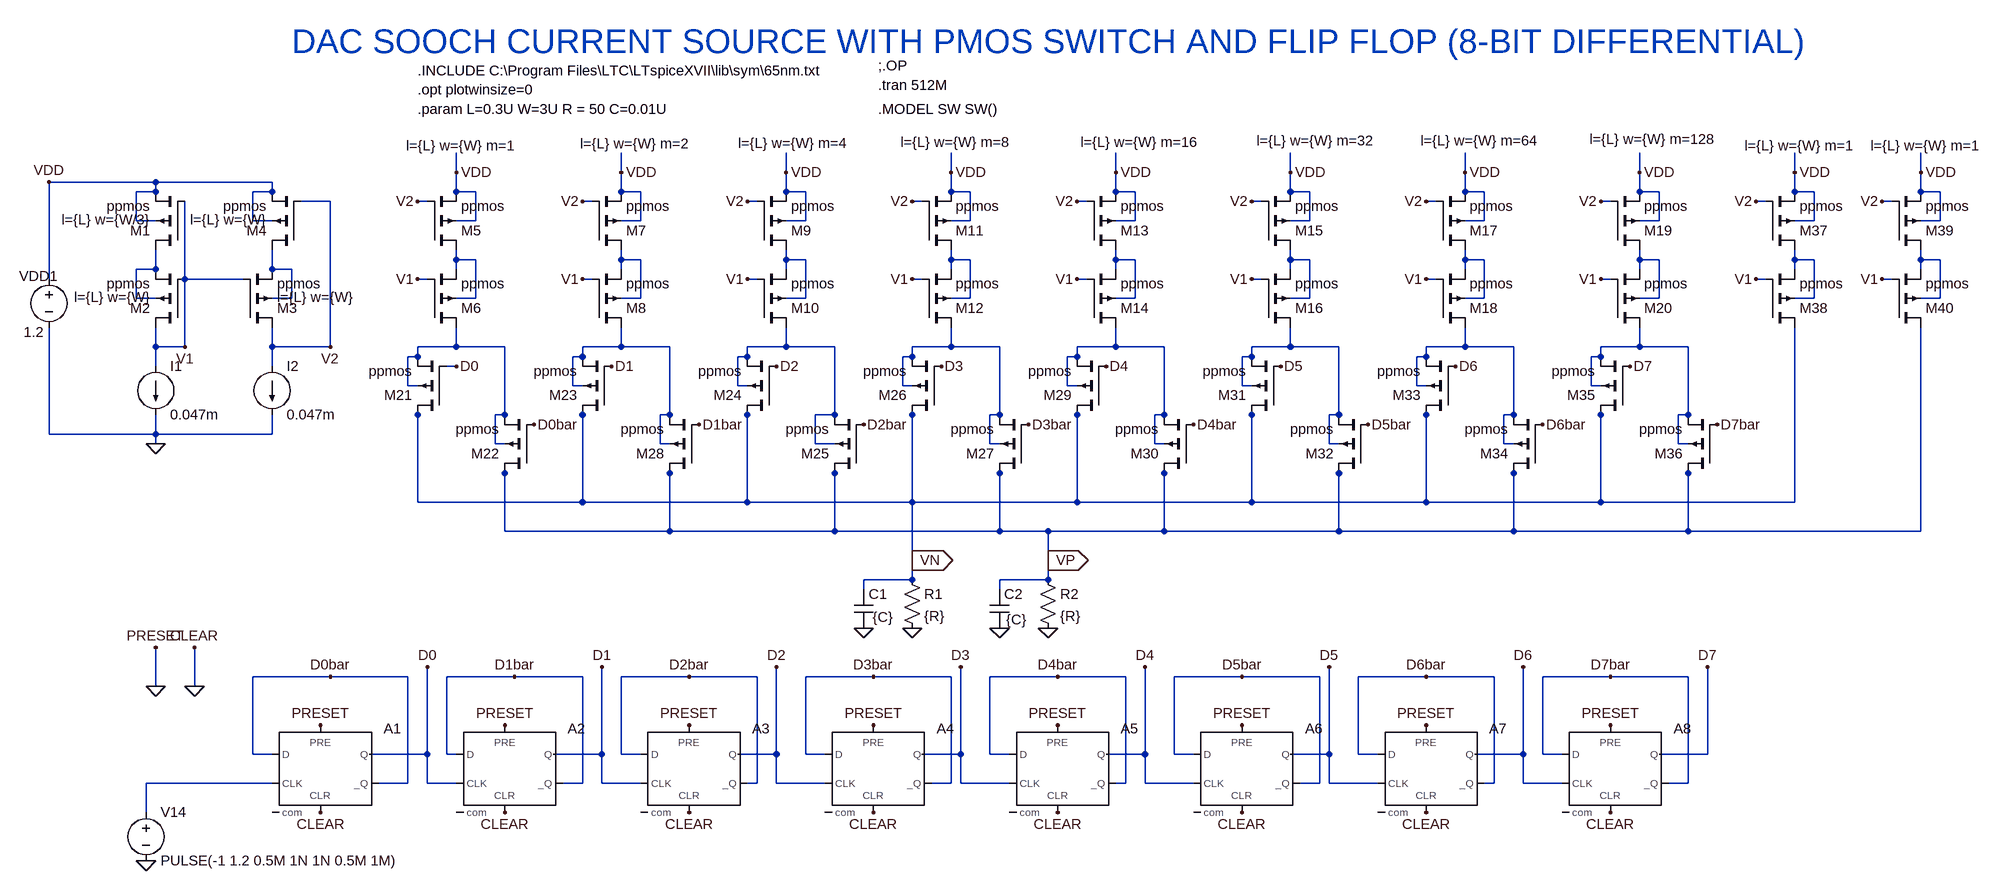
[diagram p0: schematic 106DAC_DIFF_SOOCH_PMOS_SW_FF_8BIT.asc]
106DAC_DIFF_SOOCH_PMOS_SW_FF_8BIT.asc, the LTspice schematic file:
Version 4
SHEET 1 1956 1248
WIRE -560 -336 -560 -368
WIRE -288 -336 -288 -368
WIRE -16 -336 -16 -368
WIRE 256 -336 256 -368
WIRE 528 -336 528 -368
WIRE 816 -336 816 -368
WIRE 1104 -336 1104 -368
WIRE 1392 -336 1392 -368
WIRE 1648 -336 1648 -368
WIRE 1856 -336 1856 -368
WIRE -1056 -320 -1232 -320
WIRE -864 -320 -1056 -320
WIRE -1056 -304 -1056 -320
WIRE -1056 -304 -1088 -304
WIRE -864 -304 -864 -320
WIRE -864 -304 -896 -304
WIRE -560 -304 -560 -336
WIRE -528 -304 -560 -304
WIRE -288 -304 -288 -336
WIRE -256 -304 -288 -304
WIRE -16 -304 -16 -336
WIRE 16 -304 -16 -304
WIRE 256 -304 256 -336
WIRE 288 -304 256 -304
WIRE 528 -304 528 -336
WIRE 560 -304 528 -304
WIRE 816 -304 816 -336
WIRE 848 -304 816 -304
WIRE 1104 -304 1104 -336
WIRE 1136 -304 1104 -304
WIRE 1392 -304 1392 -336
WIRE 1424 -304 1392 -304
WIRE 1648 -304 1648 -336
WIRE 1680 -304 1648 -304
WIRE 1856 -304 1856 -336
WIRE 1888 -304 1856 -304
WIRE -768 -288 -816 -288
WIRE -608 -288 -624 -288
WIRE -336 -288 -352 -288
WIRE -64 -288 -80 -288
WIRE 208 -288 192 -288
WIRE 480 -288 464 -288
WIRE 768 -288 752 -288
WIRE 1056 -288 1040 -288
WIRE 1344 -288 1328 -288
WIRE 1600 -288 1584 -288
WIRE 1808 -288 1792 -288
WIRE -1088 -256 -1088 -304
WIRE -1056 -256 -1088 -256
WIRE -896 -256 -896 -304
WIRE -864 -256 -896 -256
WIRE -528 -256 -528 -304
WIRE -528 -256 -560 -256
WIRE -256 -256 -256 -304
WIRE -256 -256 -288 -256
WIRE 16 -256 16 -304
WIRE 16 -256 -16 -256
WIRE 288 -256 288 -304
WIRE 288 -256 256 -256
WIRE 560 -256 560 -304
WIRE 560 -256 528 -256
WIRE 848 -256 848 -304
WIRE 848 -256 816 -256
WIRE 1136 -256 1136 -304
WIRE 1136 -256 1104 -256
WIRE 1424 -256 1424 -304
WIRE 1424 -256 1392 -256
WIRE 1680 -256 1680 -304
WIRE 1680 -256 1648 -256
WIRE 1888 -256 1888 -304
WIRE 1888 -256 1856 -256
WIRE -560 -192 -560 -208
WIRE -528 -192 -560 -192
WIRE -288 -192 -288 -208
WIRE -256 -192 -288 -192
WIRE -16 -192 -16 -208
WIRE 16 -192 -16 -192
WIRE 256 -192 256 -208
WIRE 288 -192 256 -192
WIRE 528 -192 528 -208
WIRE 560 -192 528 -192
WIRE 816 -192 816 -208
WIRE 848 -192 816 -192
WIRE 1104 -192 1104 -208
WIRE 1136 -192 1104 -192
WIRE 1392 -192 1392 -208
WIRE 1424 -192 1392 -192
WIRE 1648 -192 1648 -208
WIRE 1680 -192 1648 -192
WIRE 1856 -192 1856 -208
WIRE 1888 -192 1856 -192
WIRE -1056 -176 -1056 -208
WIRE -1056 -176 -1088 -176
WIRE -864 -176 -864 -208
WIRE -832 -176 -864 -176
WIRE -560 -176 -560 -192
WIRE -288 -176 -288 -192
WIRE -16 -176 -16 -192
WIRE 256 -176 256 -192
WIRE 528 -176 528 -192
WIRE 816 -176 816 -192
WIRE 1104 -176 1104 -192
WIRE 1392 -176 1392 -192
WIRE 1648 -176 1648 -192
WIRE 1856 -176 1856 -192
WIRE -1232 -160 -1232 -320
WIRE -1008 -160 -1008 -288
WIRE -912 -160 -1008 -160
WIRE -608 -160 -624 -160
WIRE -336 -160 -352 -160
WIRE -64 -160 -80 -160
WIRE 208 -160 192 -160
WIRE 480 -160 464 -160
WIRE 768 -160 752 -160
WIRE 1056 -160 1040 -160
WIRE 1344 -160 1328 -160
WIRE 1600 -160 1584 -160
WIRE 1808 -160 1792 -160
WIRE -1088 -128 -1088 -176
WIRE -1056 -128 -1088 -128
WIRE -832 -128 -832 -176
WIRE -832 -128 -864 -128
WIRE -528 -128 -528 -192
WIRE -528 -128 -560 -128
WIRE -256 -128 -256 -192
WIRE -256 -128 -288 -128
WIRE 16 -128 16 -192
WIRE 16 -128 -16 -128
WIRE 288 -128 288 -192
WIRE 288 -128 256 -128
WIRE 560 -128 560 -192
WIRE 560 -128 528 -128
WIRE 848 -128 848 -192
WIRE 848 -128 816 -128
WIRE 1136 -128 1136 -192
WIRE 1136 -128 1104 -128
WIRE 1424 -128 1424 -192
WIRE 1424 -128 1392 -128
WIRE 1680 -128 1680 -192
WIRE 1680 -128 1648 -128
WIRE 1888 -128 1888 -192
WIRE 1888 -128 1856 -128
WIRE -1056 -48 -1056 -80
WIRE -1008 -48 -1008 -160
WIRE -1008 -48 -1056 -48
WIRE -864 -48 -864 -80
WIRE -768 -48 -768 -288
WIRE -768 -48 -864 -48
WIRE -560 -48 -560 -80
WIRE -560 -48 -624 -48
WIRE -480 -48 -560 -48
WIRE -288 -48 -288 -80
WIRE -288 -48 -352 -48
WIRE -208 -48 -288 -48
WIRE -16 -48 -16 -80
WIRE -16 -48 -80 -48
WIRE 64 -48 -16 -48
WIRE 256 -48 256 -80
WIRE 256 -48 192 -48
WIRE 336 -48 256 -48
WIRE 528 -48 528 -80
WIRE 528 -48 464 -48
WIRE 608 -48 528 -48
WIRE 816 -48 816 -80
WIRE 816 -48 752 -48
WIRE 896 -48 816 -48
WIRE 1104 -48 1104 -80
WIRE 1104 -48 1040 -48
WIRE 1184 -48 1104 -48
WIRE 1392 -48 1392 -80
WIRE 1392 -48 1328 -48
WIRE 1472 -48 1392 -48
WIRE -624 -32 -624 -48
WIRE -624 -32 -640 -32
WIRE -352 -32 -352 -48
WIRE -352 -32 -368 -32
WIRE -80 -32 -80 -48
WIRE -80 -32 -96 -32
WIRE 192 -32 192 -48
WIRE 192 -32 176 -32
WIRE 464 -32 464 -48
WIRE 464 -32 448 -32
WIRE 752 -32 752 -48
WIRE 752 -32 736 -32
WIRE 1040 -32 1040 -48
WIRE 1040 -32 1024 -32
WIRE 1328 -32 1328 -48
WIRE 1328 -32 1312 -32
WIRE -1056 -16 -1056 -48
WIRE -864 -16 -864 -48
WIRE -560 -16 -576 -16
WIRE -640 16 -640 -32
WIRE -624 16 -640 16
WIRE -368 16 -368 -32
WIRE -352 16 -368 16
WIRE -96 16 -96 -32
WIRE -80 16 -96 16
WIRE 176 16 176 -32
WIRE 192 16 176 16
WIRE 448 16 448 -32
WIRE 464 16 448 16
WIRE 736 16 736 -32
WIRE 752 16 736 16
WIRE 1024 16 1024 -32
WIRE 1040 16 1024 16
WIRE 1312 16 1312 -32
WIRE 1328 16 1312 16
WIRE -624 64 -624 48
WIRE -480 64 -480 -48
WIRE -480 64 -496 64
WIRE -352 64 -352 48
WIRE -208 64 -208 -48
WIRE -208 64 -224 64
WIRE -80 64 -80 48
WIRE 64 64 64 -48
WIRE 64 64 32 64
WIRE 192 64 192 48
WIRE 336 64 336 -48
WIRE 336 64 320 64
WIRE 464 64 464 48
WIRE 608 64 608 -48
WIRE 608 64 592 64
WIRE 752 64 752 48
WIRE 896 64 896 -48
WIRE 896 64 880 64
WIRE 1040 64 1040 48
WIRE 1184 64 1184 -48
WIRE 1184 64 1168 64
WIRE 1328 64 1328 48
WIRE 1472 64 1472 -48
WIRE 1472 64 1456 64
WIRE -1232 96 -1232 -80
WIRE -1056 96 -1056 64
WIRE -1056 96 -1232 96
WIRE -864 96 -864 64
WIRE -864 96 -1056 96
WIRE -1056 112 -1056 96
WIRE -496 112 -496 64
WIRE -480 112 -496 112
WIRE -224 112 -224 64
WIRE -208 112 -224 112
WIRE 32 112 32 64
WIRE 64 112 32 112
WIRE 320 112 320 64
WIRE 336 112 320 112
WIRE 592 112 592 64
WIRE 608 112 592 112
WIRE 880 112 880 64
WIRE 896 112 880 112
WIRE 1168 112 1168 64
WIRE 1184 112 1168 112
WIRE 1456 112 1456 64
WIRE 1472 112 1456 112
WIRE -480 160 -480 144
WIRE -208 160 -208 144
WIRE 64 160 64 144
WIRE 336 160 336 144
WIRE 608 160 608 144
WIRE 896 160 896 144
WIRE 1184 160 1184 144
WIRE 1472 160 1472 144
WIRE -624 208 -624 64
WIRE -352 208 -352 64
WIRE -352 208 -624 208
WIRE -80 208 -80 64
WIRE -80 208 -352 208
WIRE 192 208 192 64
WIRE 192 208 -80 208
WIRE 464 208 464 64
WIRE 464 208 192 208
WIRE 752 208 752 64
WIRE 752 208 464 208
WIRE 1040 208 1040 64
WIRE 1040 208 752 208
WIRE 1328 208 1328 64
WIRE 1328 208 1040 208
WIRE 1648 208 1648 -80
WIRE 1648 208 1328 208
WIRE -480 256 -480 160
WIRE -208 256 -208 160
WIRE -208 256 -480 256
WIRE 64 256 64 160
WIRE 64 256 -208 256
WIRE 336 256 336 160
WIRE 336 256 64 256
WIRE 416 256 336 256
WIRE 608 256 608 160
WIRE 608 256 416 256
WIRE 896 256 896 160
WIRE 896 256 608 256
WIRE 1184 256 1184 160
WIRE 1184 256 896 256
WIRE 1472 256 1472 160
WIRE 1472 256 1184 256
WIRE 1856 256 1856 -80
WIRE 1856 256 1472 256
WIRE 192 304 192 208
WIRE 416 304 416 256
WIRE 192 336 192 304
WIRE 192 336 112 336
WIRE 416 336 416 304
WIRE 416 336 336 336
WIRE 112 352 112 336
WIRE 336 352 336 336
WIRE -768 496 -896 496
WIRE -640 496 -768 496
WIRE -464 496 -576 496
WIRE -352 496 -464 496
WIRE -176 496 -288 496
WIRE -64 496 -176 496
WIRE 128 496 16 496
WIRE 256 496 128 496
WIRE 432 496 320 496
WIRE 544 496 432 496
WIRE 736 496 624 496
WIRE 864 496 736 496
WIRE 1040 496 928 496
WIRE 1152 496 1040 496
WIRE 1344 496 1232 496
WIRE 1472 496 1344 496
WIRE -1056 512 -1056 448
WIRE -992 512 -992 448
WIRE -896 624 -896 496
WIRE -864 624 -896 624
WIRE -608 624 -608 480
WIRE -608 624 -704 624
WIRE -576 624 -576 496
WIRE -560 624 -576 624
WIRE -320 624 -320 480
WIRE -320 624 -400 624
WIRE -288 624 -288 496
WIRE -256 624 -288 624
WIRE -32 624 -32 480
WIRE -32 624 -96 624
WIRE 16 624 16 496
WIRE 48 624 16 624
WIRE 272 624 272 480
WIRE 272 624 208 624
WIRE 320 624 320 496
WIRE 352 624 320 624
WIRE 576 624 576 480
WIRE 576 624 512 624
WIRE 624 624 624 496
WIRE 656 624 624 624
WIRE 880 624 880 480
WIRE 880 624 816 624
WIRE 928 624 928 496
WIRE 960 624 928 624
WIRE 1200 624 1200 480
WIRE 1200 624 1120 624
WIRE 1232 624 1232 496
WIRE 1264 624 1232 624
WIRE 1504 624 1504 480
WIRE 1504 624 1424 624
WIRE -864 672 -1072 672
WIRE -640 672 -640 496
WIRE -640 672 -688 672
WIRE -608 672 -608 624
WIRE -560 672 -608 672
WIRE -352 672 -352 496
WIRE -352 672 -384 672
WIRE -320 672 -320 624
WIRE -256 672 -320 672
WIRE -64 672 -64 496
WIRE -64 672 -80 672
WIRE -32 672 -32 624
WIRE 48 672 -32 672
WIRE 256 672 256 496
WIRE 256 672 224 672
WIRE 272 672 272 624
WIRE 352 672 272 672
WIRE 544 672 544 496
WIRE 544 672 528 672
WIRE 576 672 576 624
WIRE 656 672 576 672
WIRE 864 672 864 496
WIRE 864 672 832 672
WIRE 880 672 880 624
WIRE 960 672 880 672
WIRE 1152 672 1152 496
WIRE 1152 672 1136 672
WIRE 1200 672 1200 624
WIRE 1264 672 1200 672
WIRE 1472 672 1472 496
WIRE 1472 672 1440 672
WIRE -1072 720 -1072 672
FLAG -1008 -48 V1
FLAG -624 -160 V1
FLAG -768 -48 V2
FLAG -624 -288 V2
FLAG -560 -336 VDD
FLAG -1232 -320 VDD
FLAG -352 -160 V1
FLAG -352 -288 V2
FLAG -288 -336 VDD
FLAG -80 -160 V1
FLAG -80 -288 V2
FLAG -16 -336 VDD
FLAG 192 -160 V1
FLAG 192 -288 V2
FLAG 256 -336 VDD
FLAG 464 -160 V1
FLAG 464 -288 V2
FLAG 528 -336 VDD
FLAG 752 -160 V1
FLAG 752 -288 V2
FLAG 816 -336 VDD
FLAG 1040 -160 V1
FLAG 1040 -288 V2
FLAG 1104 -336 VDD
FLAG 1328 -160 V1
FLAG 1328 -288 V2
FLAG 1392 -336 VDD
FLAG 192 416 0
FLAG -304 -16 D1
FLAG -32 -16 D2
FLAG 240 -16 D3
FLAG 512 -16 D4
FLAG 800 -16 D5
FLAG 1088 -16 D6
FLAG 1376 -16 D7
FLAG -1056 112 0
FLAG 112 416 0
FLAG -768 496 D0bar
FLAG -464 496 D1bar
FLAG -176 496 D2bar
FLAG 128 496 D3bar
FLAG 432 496 D4bar
FLAG 736 496 D5bar
FLAG 1040 496 D6bar
FLAG 1344 496 D7bar
FLAG -432 80 D0bar
FLAG -160 80 D1bar
FLAG 112 80 D2bar
FLAG 384 80 D3bar
FLAG 656 80 D4bar
FLAG 944 80 D5bar
FLAG 1232 80 D6bar
FLAG 1520 80 D7bar
FLAG 416 416 0
FLAG 416 304 VP
IOPIN 416 304 Out
FLAG 336 416 0
FLAG 192 304 VN
IOPIN 192 304 Out
FLAG -560 -16 D0
FLAG -608 480 D0
FLAG -320 480 D1
FLAG -32 480 D2
FLAG 272 480 D3
FLAG 576 480 D4
FLAG 880 480 D5
FLAG 1200 480 D6
FLAG 1504 480 D7
FLAG -1072 800 0
FLAG -784 576 PRESET
FLAG -480 576 PRESET
FLAG -176 576 PRESET
FLAG 128 576 PRESET
FLAG 432 576 PRESET
FLAG 736 576 PRESET
FLAG 1040 576 PRESET
FLAG 1344 576 PRESET
FLAG -1056 448 PRESET
FLAG -784 720 CLEAR
FLAG -480 720 CLEAR
FLAG -176 720 CLEAR
FLAG 128 720 CLEAR
FLAG 432 720 CLEAR
FLAG 736 720 CLEAR
FLAG 1040 720 CLEAR
FLAG 1344 720 CLEAR
FLAG -992 448 CLEAR
FLAG -992 512 0
FLAG -1056 512 0
FLAG 1584 -160 V1
FLAG 1584 -288 V2
FLAG 1648 -336 VDD
FLAG 1792 -160 V1
FLAG 1792 -288 V2
FLAG 1856 -336 VDD
SYMBOL pmos4 -1008 -208 R180
WINDOW 123 56 50 Left 2
SYMATTR Value2 l={L} w={W/3}
SYMATTR InstName M1
SYMATTR Value ppmos
SYMBOL pmos4 -1008 -80 R180
WINDOW 123 56 50 Left 2
SYMATTR Value2 l={L} w={W}
SYMATTR InstName M2
SYMATTR Value ppmos
SYMBOL current -1056 -16 R0
WINDOW 123 0 0 Left 0
WINDOW 39 0 0 Left 0
SYMATTR InstName I1
SYMATTR Value 0.047m
SYMBOL pmos4 -912 -80 M180
WINDOW 123 56 50 Left 2
SYMATTR Value2 l={L} w={W}
SYMATTR InstName M3
SYMATTR Value ppmos
SYMBOL pmos4 -816 -208 R180
WINDOW 123 56 50 Left 2
SYMATTR Value2 l={L} w={W}
SYMATTR InstName M4
SYMATTR Value ppmos
SYMBOL current -864 -16 R0
WINDOW 123 0 0 Left 0
WINDOW 39 0 0 Left 0
SYMATTR InstName I2
SYMATTR Value 0.047m
SYMBOL pmos4 -608 -208 M180
WINDOW 123 -35 172 Left 2
SYMATTR Value2 l={L} w={W} m=1
SYMATTR InstName M5
SYMATTR Value ppmos
SYMBOL pmos4 -608 -80 M180
SYMATTR Value2 l={L} w={W} m=1
SYMATTR InstName M6
SYMATTR Value ppmos
SYMBOL voltage -1232 -176 R0
WINDOW 123 0 0 Left 0
WINDOW 39 0 0 Left 0
WINDOW 0 -49 11 Left 2
WINDOW 3 -42 104 Left 2
SYMATTR InstName VDD1
SYMATTR Value 1.2
SYMBOL pmos4 -336 -208 M180
WINDOW 123 -20 175 Left 2
SYMATTR Value2 l={L} w={W} m=2
SYMATTR InstName M7
SYMATTR Value ppmos
SYMBOL pmos4 -336 -80 M180
SYMATTR Value2 l={L} w={W} m=2
SYMATTR InstName M8
SYMATTR Value ppmos
SYMBOL pmos4 -64 -208 M180
WINDOW 123 -31 176 Left 2
SYMATTR Value2 l={L} w={W} m=4
SYMATTR InstName M9
SYMATTR Value ppmos
SYMBOL pmos4 -64 -80 M180
SYMATTR Value2 l={L} w={W} m=4
SYMATTR InstName M10
SYMATTR Value ppmos
SYMBOL pmos4 208 -208 M180
WINDOW 123 -35 178 Left 2
SYMATTR Value2 l={L} w={W} m=8
SYMATTR InstName M11
SYMATTR Value ppmos
SYMBOL pmos4 208 -80 M180
SYMATTR Value2 l={L} w={W} m=8
SYMATTR InstName M12
SYMATTR Value ppmos
SYMBOL pmos4 480 -208 M180
WINDOW 123 -10 178 Left 2
SYMATTR Value2 l={L} w={W} m=16
SYMATTR InstName M13
SYMATTR Value ppmos
SYMBOL pmos4 480 -80 M180
SYMATTR Value2 l={L} w={W} m=16
SYMATTR InstName M14
SYMATTR Value ppmos
SYMBOL pmos4 768 -208 M180
WINDOW 123 -8 180 Left 2
SYMATTR Value2 l={L} w={W} m=32
SYMATTR InstName M15
SYMATTR Value ppmos
SYMBOL pmos4 768 -80 M180
SYMATTR Value2 l={L} w={W} m=32
SYMATTR InstName M16
SYMATTR Value ppmos
SYMBOL pmos4 1056 -208 M180
WINDOW 123 -25 180 Left 2
SYMATTR Value2 l={L} w={W} m=64
SYMATTR InstName M17
SYMATTR Value ppmos
SYMBOL pmos4 1056 -80 M180
SYMATTR Value2 l={L} w={W} m=64
SYMATTR InstName M18
SYMATTR Value ppmos
SYMBOL pmos4 1344 -208 M180
WINDOW 123 -34 183 Left 2
SYMATTR Value2 l={L} w={W} m=128
SYMATTR InstName M19
SYMATTR Value ppmos
SYMBOL pmos4 1344 -80 M180
SYMATTR Value2 l={L} w={W} m=128
SYMATTR InstName M20
SYMATTR Value ppmos
SYMBOL res 176 320 R0
SYMATTR InstName R1
SYMATTR Value {R}
SYMBOL cap 96 352 R0
WINDOW 3 31 46 Left 2
SYMATTR Value {C}
SYMATTR InstName C1
SYMBOL res 400 320 R0
SYMATTR InstName R2
SYMATTR Value {R}
SYMBOL cap 320 352 R0
WINDOW 3 27 50 Left 2
SYMATTR Value {C}
SYMATTR InstName C2
SYMBOL pmos4 -576 64 R180
SYMATTR Value2 l={L} w={W} m=1
SYMATTR InstName M21
SYMATTR Value ppmos
SYMBOL pmos4 -432 160 R180
SYMATTR Value2 l={L} w={W} m=1
SYMATTR InstName M22
SYMATTR Value ppmos
SYMBOL pmos4 -304 64 R180
SYMATTR Value2 l={L} w={W} m=2
SYMATTR InstName M23
SYMATTR Value ppmos
SYMBOL pmos4 -32 64 R180
SYMATTR Value2 l={L} w={W} m=4
SYMATTR InstName M24
SYMATTR Value ppmos
SYMBOL pmos4 112 160 R180
SYMATTR Value2 l={L} w={W} m=4
SYMATTR InstName M25
SYMATTR Value ppmos
SYMBOL pmos4 240 64 R180
SYMATTR Value2 l={L} w={W} m=8
SYMATTR InstName M26
SYMATTR Value ppmos
SYMBOL pmos4 384 160 R180
SYMATTR Value2 l={L} w={W} m=8
SYMATTR InstName M27
SYMATTR Value ppmos
SYMBOL pmos4 -160 160 R180
SYMATTR Value2 l={L} w={W} m=2
SYMATTR InstName M28
SYMATTR Value ppmos
SYMBOL pmos4 512 64 R180
SYMATTR Value2 l={L} w={W} m=16
SYMATTR InstName M29
SYMATTR Value ppmos
SYMBOL pmos4 656 160 R180
SYMATTR Value2 l={L} w={W} m=16
SYMATTR InstName M30
SYMATTR Value ppmos
SYMBOL pmos4 800 64 R180
SYMATTR Value2 l={L} w={W} m=32
SYMATTR InstName M31
SYMATTR Value ppmos
SYMBOL pmos4 944 160 R180
SYMATTR Value2 l={L} w={W} m=32
SYMATTR InstName M32
SYMATTR Value ppmos
SYMBOL pmos4 1088 64 R180
SYMATTR Value2 l={L} w={W} m=64
SYMATTR InstName M33
SYMATTR Value ppmos
SYMBOL pmos4 1232 160 R180
SYMATTR Value2 l={L} w={W} m=64
SYMATTR InstName M34
SYMATTR Value ppmos
SYMBOL pmos4 1376 64 R180
SYMATTR Value2 l={L} w={W} m=128
SYMATTR InstName M35
SYMATTR Value ppmos
SYMBOL pmos4 1520 160 R180
SYMATTR Value2 l={L} w={W} m=128
SYMATTR InstName M36
SYMATTR Value ppmos
SYMBOL Digital\\dflop -784 576 R0
SYMATTR InstName A1
SYMBOL Digital\\dflop -480 576 R0
SYMATTR InstName A2
SYMBOL Digital\\dflop -176 576 R0
SYMATTR InstName A3
SYMBOL Digital\\dflop 128 576 R0
SYMATTR InstName A4
SYMBOL Digital\\dflop 432 576 R0
SYMATTR InstName A5
SYMBOL Digital\\dflop 736 576 R0
SYMATTR InstName A6
SYMBOL Digital\\dflop 1040 576 R0
SYMATTR InstName A7
SYMBOL Digital\\dflop 1344 576 R0
SYMATTR InstName A8
SYMBOL voltage -1072 704 R0
WINDOW 123 0 0 Left 0
WINDOW 39 0 0 Left 0
SYMATTR InstName V14
SYMATTR Value PULSE(-1 1.2 0.5M 1N 1N 0.5M 1M)
SYMBOL pmos4 1600 -208 M180
WINDOW 123 -35 172 Left 2
SYMATTR Value2 l={L} w={W} m=1
SYMATTR InstName M37
SYMATTR Value ppmos
SYMBOL pmos4 1600 -80 M180
SYMATTR Value2 l={L} w={W} m=1
SYMATTR InstName M38
SYMATTR Value ppmos
SYMBOL pmos4 1808 -208 M180
WINDOW 123 -35 172 Left 2
SYMATTR Value2 l={L} w={W} m=1
SYMATTR InstName M39
SYMATTR Value ppmos
SYMBOL pmos4 1808 -80 M180
SYMATTR Value2 l={L} w={W} m=1
SYMATTR InstName M40
SYMATTR Value ppmos
TEXT -624 -504 Left 2 !.INCLUDE C:\\Program Files\\LTC\\LTspiceXVII\\lib\\sym\\65nm.txt
TEXT -624 -472 Left 2 !.opt plotwinsize=0
TEXT 136 -512 Left 2 !;.OP
TEXT -624 -440 Left 2 !.param L=0.3U W=3U R = 50 C=0.01U
TEXT 136 -480 Left 2 !.tran 512M
TEXT 136 -440 Left 2 !.MODEL SW SW()
TEXT -832 -552 Left 5 ;DAC SOOCH CURRENT SOURCE WITH PMOS SWITCH AND FLIP FLOP (8-BIT DIFFERENTIAL)

The netlist it stands for:
* 106DAC_DIFF_SOOCH_PMOS_SW_FF_8BIT.asc
M1 N011 V1 VDD VDD ppmos l={L} w={W/3}
M2 V1 V1 N011 N011 ppmos l={L} w={W}
I1 V1 0 0.047m
M3 V2 V1 N012 N012 ppmos l={L} w={W}
M4 N012 V2 VDD VDD ppmos l={L} w={W}
I2 V2 0 0.047m
M5 N001 V2 VDD VDD ppmos l={L} w={W} m=1
M6 N013 V1 N001 N001 ppmos l={L} w={W} m=1
VDD1 VDD 0 1.2
M7 N002 V2 VDD VDD ppmos l={L} w={W} m=2
M8 N014 V1 N002 N002 ppmos l={L} w={W} m=2
M9 N003 V2 VDD VDD ppmos l={L} w={W} m=4
M10 N015 V1 N003 N003 ppmos l={L} w={W} m=4
M11 N004 V2 VDD VDD ppmos l={L} w={W} m=8
M12 N016 V1 N004 N004 ppmos l={L} w={W} m=8
M13 N005 V2 VDD VDD ppmos l={L} w={W} m=16
M14 N017 V1 N005 N005 ppmos l={L} w={W} m=16
M15 N006 V2 VDD VDD ppmos l={L} w={W} m=32
M16 N018 V1 N006 N006 ppmos l={L} w={W} m=32
M17 N007 V2 VDD VDD ppmos l={L} w={W} m=64
M18 N019 V1 N007 N007 ppmos l={L} w={W} m=64
M19 N008 V2 VDD VDD ppmos l={L} w={W} m=128
M20 N020 V1 N008 N008 ppmos l={L} w={W} m=128
R1 VN 0 {R}
C1 VN 0 {C}
R2 VP 0 {R}
C2 VP 0 {C}
M21 VN D0 N013 N013 ppmos l={L} w={W} m=1
M22 VP D0bar N013 N013 ppmos l={L} w={W} m=1
M23 VN D1 N014 N014 ppmos l={L} w={W} m=2
M24 VN D2 N015 N015 ppmos l={L} w={W} m=4
M25 VP D2bar N015 N015 ppmos l={L} w={W} m=4
M26 VN D3 N016 N016 ppmos l={L} w={W} m=8
M27 VP D3bar N016 N016 ppmos l={L} w={W} m=8
M28 VP D1bar N014 N014 ppmos l={L} w={W} m=2
M29 VN D4 N017 N017 ppmos l={L} w={W} m=16
M30 VP D4bar N017 N017 ppmos l={L} w={W} m=16
M31 VN D5 N018 N018 ppmos l={L} w={W} m=32
M32 VP D5bar N018 N018 ppmos l={L} w={W} m=32
M33 VN D6 N019 N019 ppmos l={L} w={W} m=64
M34 VP D6bar N019 N019 ppmos l={L} w={W} m=64
M35 VN D7 N020 N020 ppmos l={L} w={W} m=128
M36 VP D7bar N020 N020 ppmos l={L} w={W} m=128
A1 D0bar 0 N021 0 0 D0bar D0 0 DFLOP
A2 D1bar 0 D0 0 0 D1bar D1 0 DFLOP
A3 D2bar 0 D1 0 0 D2bar D2 0 DFLOP
A4 D3bar 0 D2 0 0 D3bar D3 0 DFLOP
A5 D4bar 0 D3 0 0 D4bar D4 0 DFLOP
A6 D5bar 0 D4 0 0 D5bar D5 0 DFLOP
A7 D6bar 0 D5 0 0 D6bar D6 0 DFLOP
A8 D7bar 0 D6 0 0 D7bar D7 0 DFLOP
V14 N021 0 PULSE(-1 1.2 0.5M 1N 1N 0.5M 1M)
M37 N009 V2 VDD VDD ppmos l={L} w={W} m=1
M38 VN V1 N009 N009 ppmos l={L} w={W} m=1
M39 N010 V2 VDD VDD ppmos l={L} w={W} m=1
M40 VP V1 N010 N010 ppmos l={L} w={W} m=1
.model NMOS NMOS
.model PMOS PMOS
.lib standard.mos
.INCLUDE C:\Program Files\LTC\LTspiceXVII\lib\sym\65nm.txt
.opt plotwinsize=0
;.OP
.param L=0.3U W=3U R = 50 C=0.01U
.tran 512M
.MODEL SW SW()
* DAC SOOCH CURRENT SOURCE WITH PMOS SWITCH AND FLIP FLOP (8-BIT DIFFERENTIAL)
.backanno
.end